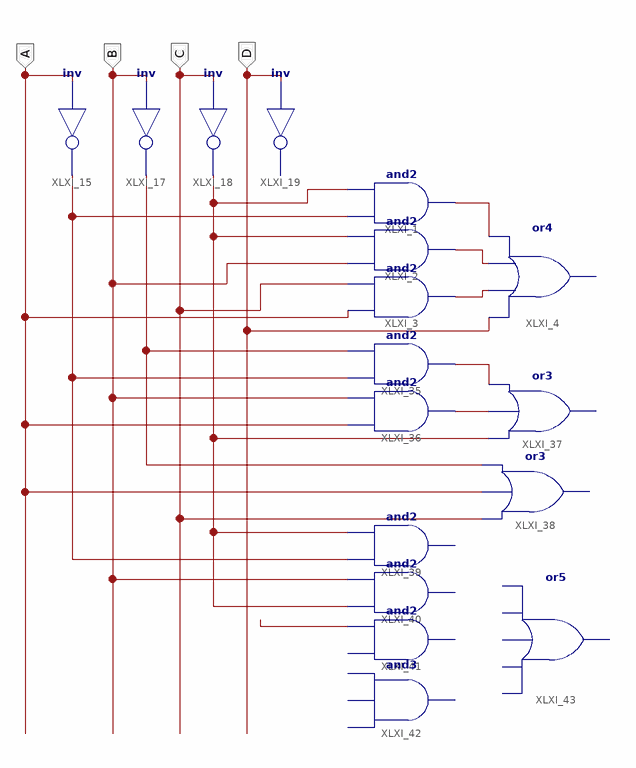
[diagram p0: schematic sheet 1]
// Xilinx ISE schematic Counting.sch (spartan6) as structural Verilog: 17 symbols, 4 ports
module Counting (
  input  B,
  input  A,
  input  C,
  input  D
);

  wire XLXN_11, XLXN_12, XLXN_32, XLXN_33, XLXN_34, XLXN_44, XLXN_45, XLXN_47, XLXN_57;

  // or4 XLXI_4 has open pins: I0=D, I1=XLXN_34, I2=XLXN_33, I3=XLXN_32, O=open
  not XLXI_17 (XLXN_47, B);
  not XLXI_15 (XLXN_11, A);
  not XLXI_18 (XLXN_12, C);
  // inv XLXI_19 has open pins: I=D, O=open
  and XLXI_1 (XLXN_32, XLXN_11, XLXN_12);
  and XLXI_2 (XLXN_33, B, XLXN_12);
  and XLXI_3 (XLXN_34, A, C);
  and XLXI_35 (XLXN_44, XLXN_11, XLXN_47);
  and XLXI_36 (XLXN_45, A, B);
  // or3 XLXI_37 has open pins: I0=XLXN_12, I1=XLXN_45, I2=XLXN_44, O=open
  // or3 XLXI_38 has open pins: I0=C, I1=A, I2=XLXN_47, O=open
  // and2 XLXI_39 has open pins: I0=XLXN_11, I1=XLXN_12, O=open
  // and2 XLXI_40 has open pins: I0=XLXN_12, I1=B, O=open
  // and2 XLXI_41 has open pins: I0=open, I1=XLXN_57, O=open
  // and3 XLXI_42 is placed but not wired
  // or5 XLXI_43 is placed but not wired
endmodule
